# EAGLE design Minimum LPC2148+GPS (EAGLE 6.91.2)
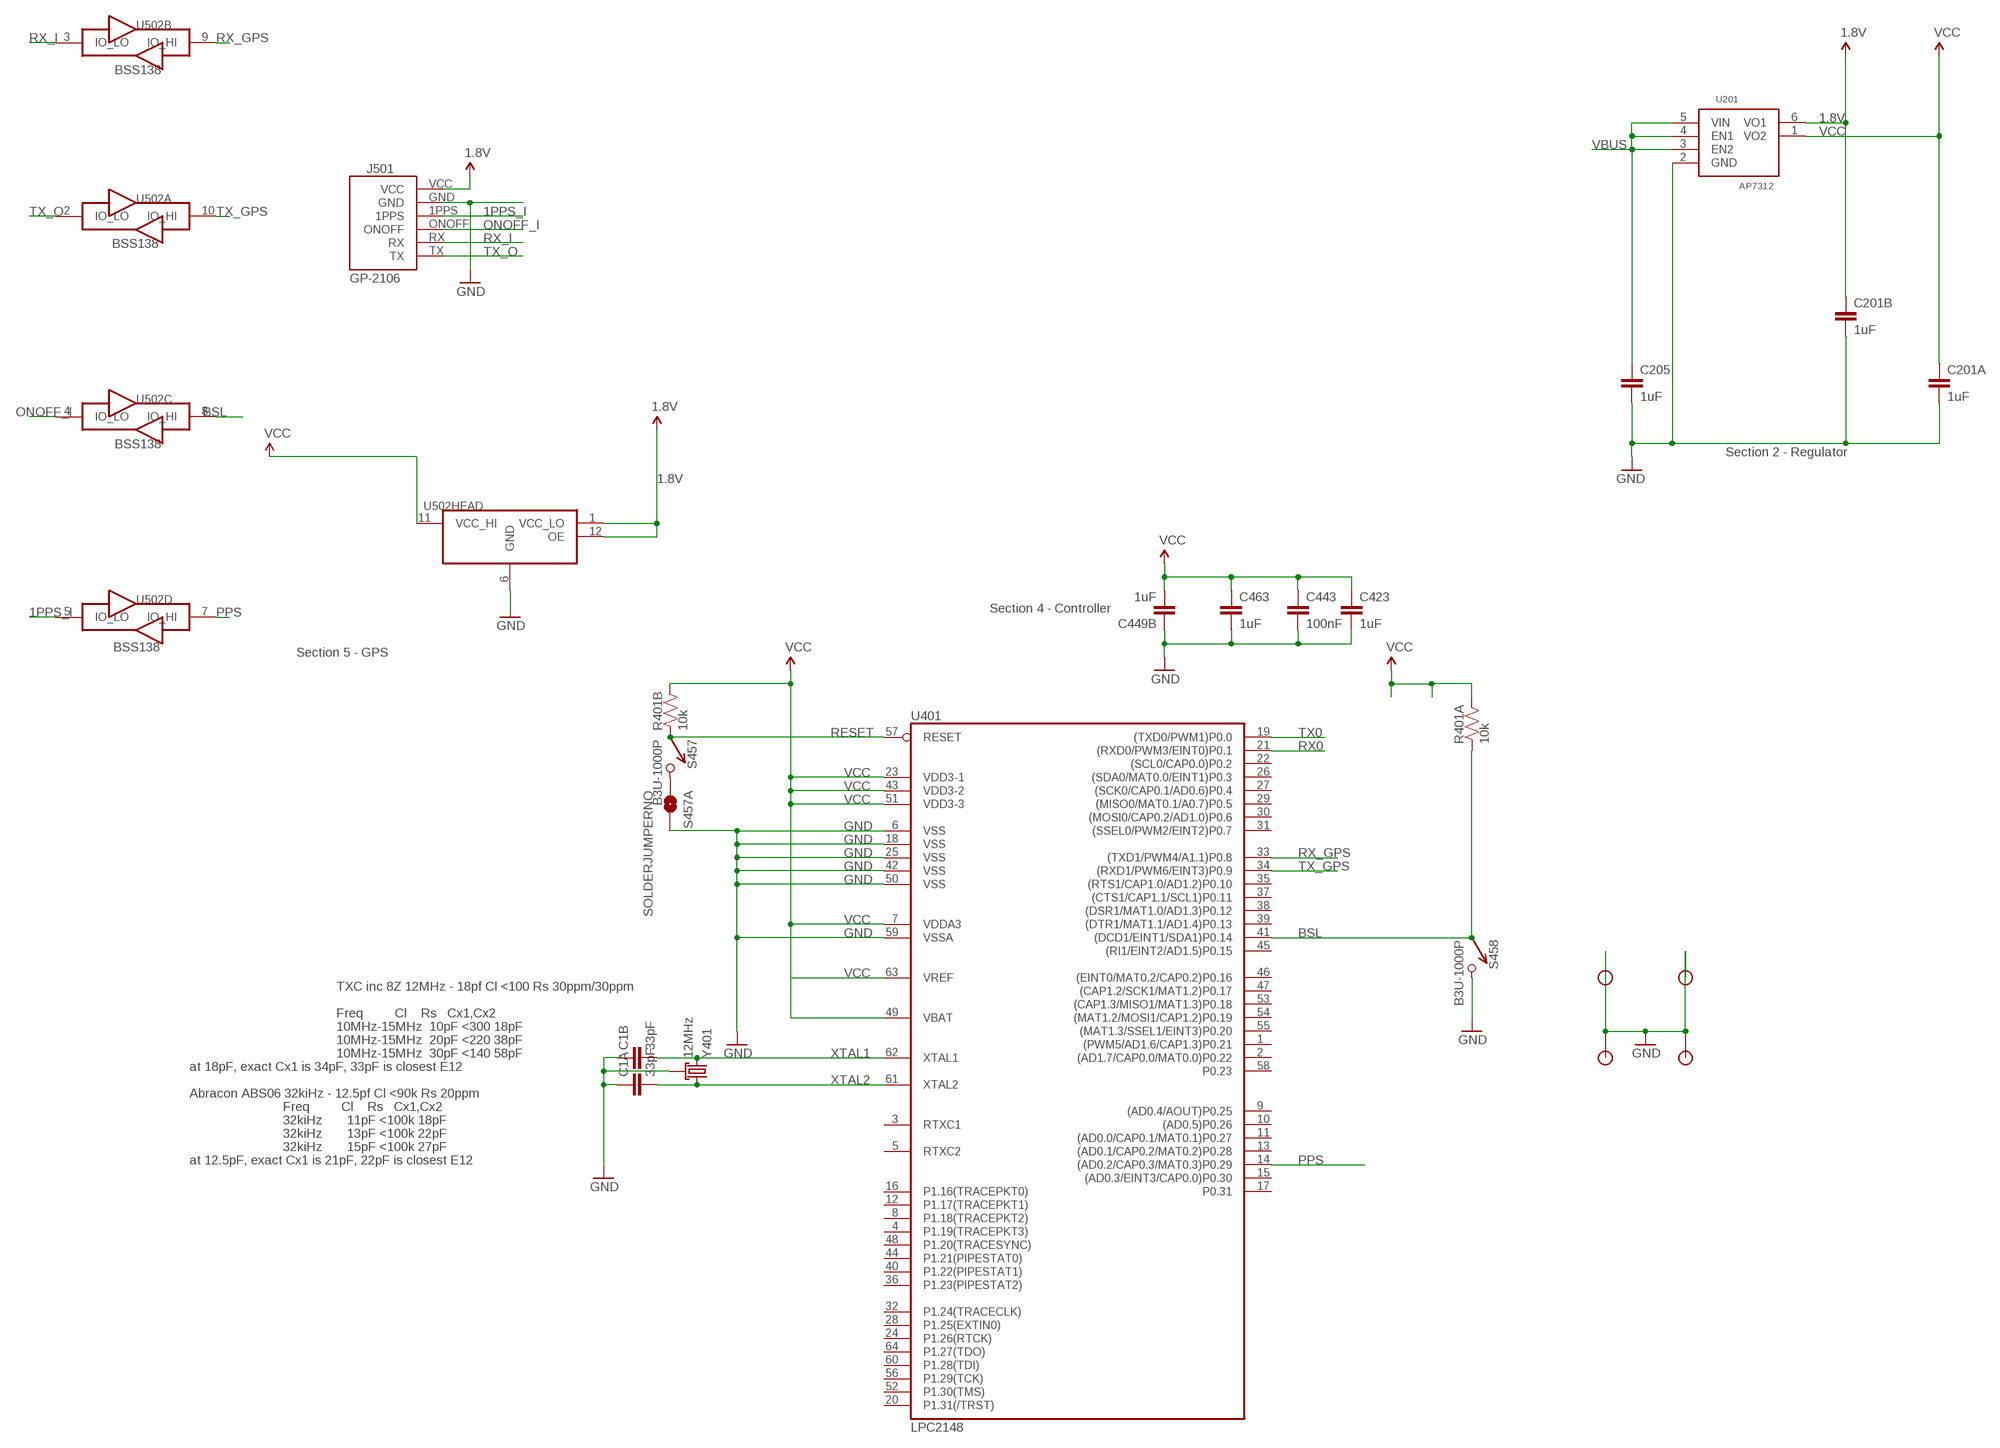
[diagram p0: schematic, sheet 1]

## Parts
C1  33pF  CKCM25  [CKCM25]
C201  1uF  CKCM25  [CKCM25]
C205  1uF  CAP0402-CAP  [0402-CAP]
C423  1uF  CAP0402-CAP  [0402-CAP]
C443  100nF  CAP0402-CAP  [0402-CAP]
C449  1uF  CKCM25  [CKCM25]
C463  1uF  CAP0402-CAP  [0402-CAP]
J501  GP-2106  [GP-2106]
JP1  STANDOFF  [STANDOFF]
JP2  STANDOFF  [STANDOFF]
JP4  STANDOFF  [STANDOFF]
JP5  STANDOFF  [STANDOFF]
R401  10k  RP2EXB24V  [CRA02]
S457  B3U-1000P  [B3U-1000P]
S457A  SOLDERJUMPERNO  [SJ_2S-NO]
S458  B3U-1000P  [B3U-1000P]
U201  AP7312  AP73X2  [SOT-23-6]
U401  LPC2148  LPC213X  [SQFP-S-10X10-64]
U502  TXB0104RUT  [R-PUQFN-N12]
Y401  12MHz  CX2520  [CRYSTAL_SMD_2MM_2_5MM]

## Nets
1.8V: C201.2 J501.VCC U201.6(VO1) U502.1(HEAD:VCC_LO) U502.12(HEAD:OE)
1PPS_I: J501.1PPS U502.5(D:IO_LO)
BSL: R401.1 S458.P$1 U401.41((DCD1/EINT1/SDA1)P0.14) U502.8(C:IO_HI)
GND [power]: C1.1 C1.2 C201.3 C201.4 C205.2 C423.2 C443.2 C449.2 C463.2 J501.GND JP1.P$1 JP2.P$1 JP4.P$1 JP5.P$1 S457A.2 S458.P$2 U201.2(GND) U401.6(VSS) U401.18(VSS) U401.25(VSS) U401.42(VSS) U401.50(VSS) U401.59(VSSA) U502.6(HEAD:GND) Y401.2(GND) Y401.4(GND)
N$8: S457.P$2 S457A.1
ONOFF_I: J501.ONOFF U502.4(C:IO_LO)
PPS: U401.14((AD0.2/CAP0.3/MAT0.3)P0.29) U502.7(D:IO_HI)
RESET [power]: R401.2 S457.P$1 U401.57(RESET)
RX0: U401.21((RXD0/PWM3/EINT0)P0.1)
RX_GPS: U401.33((TXD1/PWM4/A1.1)P0.8) U502.9(B:IO_HI)
RX_I: J501.RX U502.3(B:IO_LO)
TX0: U401.19((TXD0/PWM1)P0.0)
TX_GPS: U401.34((RXD1/PWM6/EINT3)P0.9) U502.10(A:IO_HI)
TX_O: J501.TX U502.2(A:IO_LO)
VBUS [power]: C205.1 U201.3(EN2) U201.4(EN1) U201.5(VIN)
VCC [power]: C201.1 C423.1 C443.1 C449.3 C463.1 R401.3 R401.4 U201.1(VO2) U401.7(VDDA3) U401.23(VDD3-1) U401.43(VDD3-2) U401.49(VBAT) U401.51(VDD3-3) U401.63(VREF) U502.11(HEAD:VCC_HI)
XTAL1: C1.3 U401.62(XTAL1) Y401.3
XTAL2: C1.4 U401.61(XTAL2) Y401.1
Unconnected: C449.1 C449.4 U401.1((PWM5/AD1.6/CAP1.3)P0.21) U401.2((AD1.7/CAP0.0/MAT0.0)P0.22) U401.3(RTXC1) U401.4(P1.19(TRACEPKT3)) U401.5(RTXC2) U401.8(P1.18(TRACEPKT2)) U401.9((AD0.4/AOUT)P0.25) U401.10((AD0.5)P0.26) U401.11((AD0.0/CAP0.1/MAT0.1)P0.27) U401.12(P1.17(TRACEPKT1)) U401.13((AD0.1/CAP0.2/MAT0.2)P0.28) U401.15((AD0.3/EINT3/CAP0.0)P0.30) U401.16(P1.16(TRACEPKT0)) U401.17(P0.31) U401.20(P1.31(/TRST)) U401.22((SCL0/CAP0.0)P0.2) U401.24(P1.26(RTCK)) U401.26((SDA0/MAT0.0/EINT1)P0.3) U401.27((SCK0/CAP0.1/AD0.6)P0.4) U401.28(P1.25(EXTIN0)) U401.29((MISO0/MAT0.1/A0.7)P0.5) U401.30((MOSI0/CAP0.2/AD1.0)P0.6) U401.31((SSEL0/PWM2/EINT2)P0.7) U401.32(P1.24(TRACECLK)) U401.35((RTS1/CAP1.0/AD1.2)P0.10) U401.36(P1.23(PIPESTAT2)) U401.37((CTS1/CAP1.1/SCL1)P0.11) U401.38((DSR1/MAT1.0/AD1.3)P0.12) U401.39((DTR1/MAT1.1/AD1.4)P0.13) U401.40(P1.22(PIPESTAT1)) U401.44(P1.21(PIPESTAT0)) U401.45((RI1/EINT2/AD1.5)P0.15) U401.46((EINT0/MAT0.2/CAP0.2)P0.16) U401.47((CAP1.2/SCK1/MAT1.2)P0.17) U401.48(P1.20(TRACESYNC)) U401.52(P1.30(TMS)) U401.53((CAP1.3/MISO1/MAT1.3)P0.18) U401.54((MAT1.2/MOSI1/CAP1.2)P0.19) U401.55((MAT1.3/SSEL1/EINT3)P0.20) U401.56(P1.29(TCK)) U401.58(P0.23) U401.60(P1.28(TDI)) U401.64(P1.27(TDO))

## Notes on the sheet
- BSS138
- BSS138
- BSS138
- Section 2 - Regulator
- Section 4 - Controller
- BSS138
- Section 5 - GPS
- TXC inc 8Z 12MHz - 18pf Cl <100 Rs 30ppm/30ppm
- Freq         Cl    Rs   Cx1,Cx2
- 10MHz-15MHz  10pF <300 18pF
- 10MHz-15MHz  20pF <220 38pF
- 10MHz-15MHz  30pF <140 58pF
- at 18pF, exact Cx1 is 34pF, 33pF is closest E12
- Abracon ABS06 32kiHz - 12.5pf Cl <90k Rs 20ppm
- Freq         Cl    Rs   Cx1,Cx2
- 32kiHz       11pF <100k 18pF
- 32kiHz       13pF <100k 22pF
- 32kiHz       15pF <100k 27pF
- at 12.5pF, exact Cx1 is 21pF, 22pF is closest E12

## Library data of the parts
C1 C201 C449 = KwanSystems:CKC
C205 C423 C463 = SparkFun:CAP: Capacitor Standard 0603 ceramic capacitor, and 0.1" leaded capacitor.; DIGIKEY: 445-4114-1-ND
C443 = SparkFun:CAP: Capacitor Standard 0603 ceramic capacitor, and 0.1" leaded capacitor.; DIGIKEY: 445-1265-1-ND
J501 = SparkFun:GP-2106: GP-2106 GPS SiRF IV
JP1 JP2 JP4 JP5 = KwanSystems:STANDOFF; DIGIKEY: $NOPART
R401 = KwanSystems:RP2; DIGIKEY: CRA4S810KCT-ND
S457 S458 = KwanSystems:B3U-1000P; DIGIKEY: SW1020CT-ND
S457A = SparkFun-Passives:SOLDERJUMPER: Solder Jumper Standard SMD solder jumper. Used to automate production. Two varients : Normally Open and Normally Closed are the same, but have different paste layers. NC will have a large amount of paste and should jumper during reflow.; DIGIKEY: $NOPART
U201 = KwanSystems:AP73X2: Dual 300mA LDO Regulator http://www.diodes.com/datasheets/AP7332.pdf
U401 = SparkFun:LPC213X: LPC213x Schematic element and footprint for NXP LPC213x. Spark Fun Electronics SKU : COM-00520; DIGIKEY: 568-1765-ND
U502 = KwanSystems:TXB0104
Y401 = KwanSystems:CX2520; DIGIKEY: 887-1487-1-ND

## Net classes
0 default: width 0.152 mm, drill 0.33 mm, clearance 0.152 mm
1 power: width 0.152 mm, drill 0.33 mm, clearance 0.152 mm to class 0, clearance 0.152 mm
2 hv: width 0.152 mm, drill 0.33 mm, clearance 0.152 mm to class 0, clearance 0.152 mm to class 1, clearance 0.152 mm

## Board
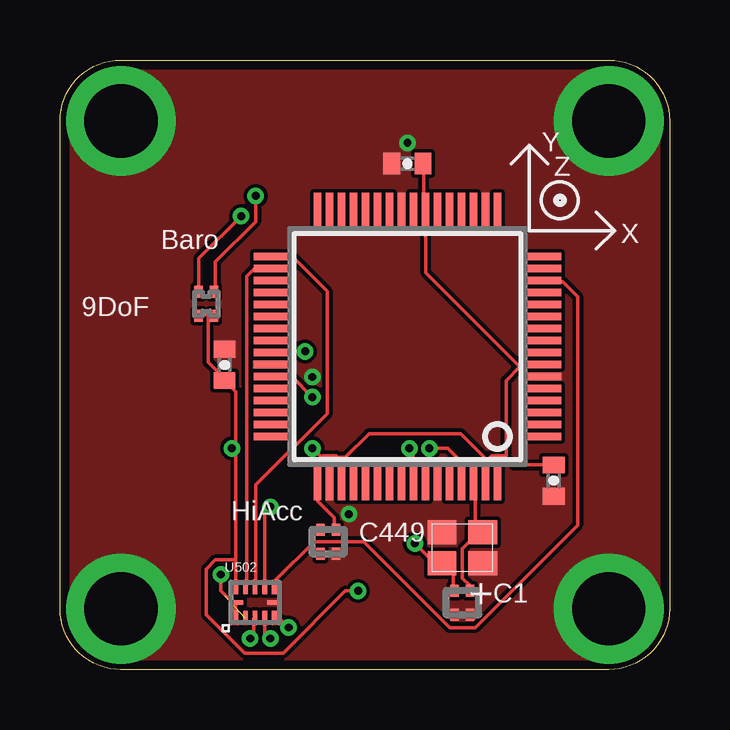
[diagram p1: board, top side]
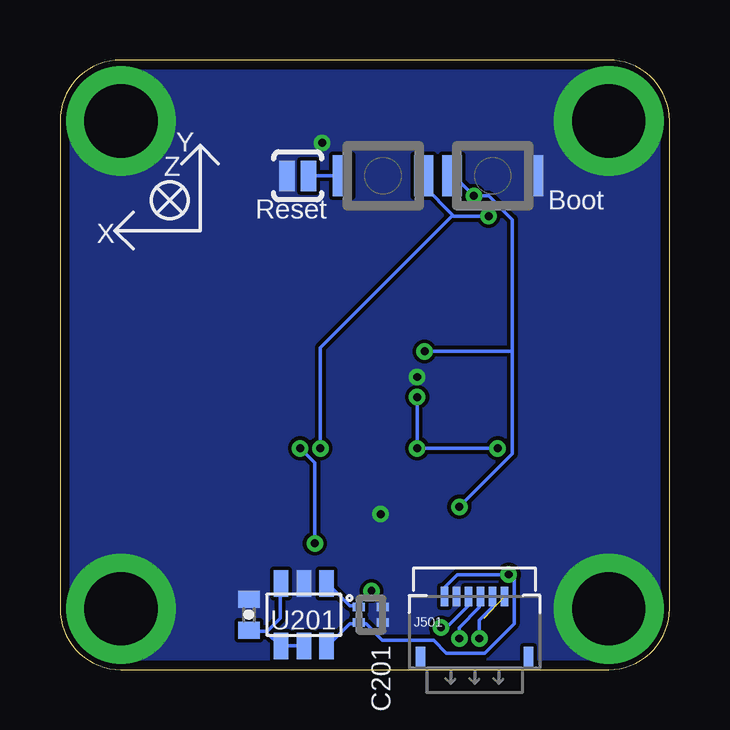
[diagram p2: board, bottom side, seen from below]

Size 25.4 x 25.4 mm. Coordinates in mm from the lower left corner, seen from the top.
Outline: 2.54,25.4 22.86,25.4 arc-90 25.4,22.86 25.4,2.54 arc-90 22.86,0 2.54,0 arc-90 0,2.54 0,22.86 arc-90 2.54,25.4
Copper layers (1*16): Top 0.0356mm / dielectric 1.5011mm / Bottom 0.0356mm
Design rules "default": minimum track width 6mil, minimum drill 13mil, track to track 6mil, track to pad 6mil, pad to pad 6mil, via to via 6mil, smd to smd 6mil, copper to edge 15mil, drill to drill 6mil, minimum pad ring 7mil, minimum via ring 7mil, stop-mask expansion 4mil, vias tented up to drill 14mil, thermal gap 10mil

### Footprints (pad centres in the part's own frame; a part is rotated, then mirrored left to right if it is on the bottom)
CKCM25 = smd 0.35 x 0.5: 1 -0.325,-0.5; 2 0.325,-0.5; 3 0.325,0.5; 4 -0.325,0.5
0402-CAP = smd 0.7 x 0.9: 1 -0.65,0; 2 0.65,0
GP-2106 = smd 0.3 x 0.8: 1PPS -0.25,0; GND -0.75,0; ONOFF 0.25,0; RX 0.75,0; TX 1.25,0; VCC -1.25,0 | smd 0.4 x 0.8: P$7 -2.25,-2.5; P$8 2.25,-2.5
STANDOFF = drill 3.048 pad 4.572: P$1 0,0
CRA02 = smd 0.35 x 0.5: 1 -0.325,-0.5; 2 0.325,-0.5; 3 0.325,0.5; 4 -0.325,0.5
B3U-1000P = smd 0.8 x 1.7: P$1 -1.7,0; P$2 1.7,0
SJ_2S-NO = smd 0.635 x 1.27: 1 -0.45,0; 2 0.45,0
SOT-23-6 = smd 0.6 x 1.1: 1 -0.95,-1.3; 2 0,-1.3; 3 0.95,-1.3; 4 0.95,1.3; 5 0,1.3; 6 -0.95,1.3
SQFP-S-10X10-64 = smd 0.3 x 1.6: 1 -3.75,-5.6; 2 -3.25,-5.6; 3 -2.75,-5.6; 4 -2.25,-5.6; 5 -1.75,-5.6; 6 -1.25,-5.6; 7 -0.75,-5.6; 8 -0.25,-5.6; 9 0.25,-5.6; 10 0.75,-5.6; 11 1.25,-5.6; 12 1.75,-5.6; 13 2.25,-5.6; 14 2.75,-5.6; 15 3.25,-5.6; 16 3.75,-5.6; 33 3.75,5.6; 34 3.25,5.6; 35 2.75,5.6; 36 2.25,5.6; 37 1.75,5.6; 38 1.25,5.6; 39 0.75,5.6; 40 0.25,5.6; 41 -0.25,5.6; 42 -0.75,5.6; 43 -1.25,5.6; 44 -1.75,5.6; 45 -2.25,5.6; 46 -2.75,5.6; 47 -3.25,5.6; 48 -3.75,5.6 | smd 1.6 x 0.3: 17 5.6,-3.75; 18 5.6,-3.25; 19 5.6,-2.75; 20 5.6,-2.25; 21 5.6,-1.75; 22 5.6,-1.25; 23 5.6,-0.75; 24 5.6,-0.25; 25 5.6,0.25; 26 5.6,0.75; 27 5.6,1.25; 28 5.6,1.75; 29 5.6,2.25; 30 5.6,2.75; 31 5.6,3.25; 32 5.6,3.75; 49 -5.6,3.75; 50 -5.6,3.25; 51 -5.6,2.75; 52 -5.6,2.25; 53 -5.6,1.75; 54 -5.6,1.25; 55 -5.6,0.75; 56 -5.6,0.25; 57 -5.6,-0.25; 58 -5.6,-0.75; 59 -5.6,-1.25; 60 -5.6,-1.75; 61 -5.6,-2.25; 62 -5.6,-2.75; 63 -5.6,-3.25; 64 -5.6,-3.75
R-PUQFN-N12 = smd 0.2 x 0.6: 1 -0.8,-0.65; 2 -0.4,-0.65; 3 0,-0.65; 4 0.4,-0.65; 5 0.8,-0.65; 7 0.8,0.65; 8 0.4,0.65; 9 0,0.65; 10 -0.4,0.65; 11 -0.8,0.65 | smd 0.6 x 0.2: 6 0.8,0; 12 -0.8,0
CRYSTAL_SMD_2MM_2_5MM = smd 1.2 x 1: 1 -0.85,-0.65; 2 0.85,-0.65; 3 0.85,0.65; 4 -0.85,0.65

### Placement (x,y rotation side)
C1  16.76,2.79 0 top
C201  12.45,2.29 270 bottom
C205  17.53,2.29 90 bottom
C423  14.48,21.08 180 top
C443  6.86,12.7 90 top
C449  11.18,5.33 0 top
C463  20.57,7.87 270 top
J501  8.13,3.05 0 bottom
JP1  2.54,2.54 0 top
JP2  2.54,22.86 0 top
JP4  22.86,2.54 0 top
JP5  22.86,22.86 0 top
R401  6.1,15.24 180 top
S457  11.94,20.57 180 bottom
S457A  15.49,20.57 180 bottom
S458  7.37,20.57 0 bottom
U201  15.24,2.29 180 bottom
U401  14.48,13.46 90 top
U502  8.13,2.79 0 top
U$4  [AXES]  19.56,18.29 0 top
Y401  16.76,5.08 0 top

### Tracks (layer width: path | path; a pad name or v marks a point on that pad's centre or on a via)
1.8V  (via drill 0.33)
  Top 0.152: U502.1 7.32,2.21 7.32,2.74 U502.12 7.24,2.74 6.71,3.28 v6.71,3.96
  Bottom 0.152: U201.6 14.25,0.99 13.34,1.91 12.95,1.91 C201.2 12.88,1.91 12.65,1.91 11.96,1.22 9.83,1.22 9.3,0.69 7.7,0.69 6.48,1.91 6.48,3.73 v6.71,3.96 8.84,3.96 9.37,3.43 J501.VCC
1PPS_I  (via drill 0.33)
  Top 0.152: v9.53,1.75 9.14,2.13 8.99,2.13 U502.5
  Bottom 0.152: v9.53,1.75 9.3,1.75 8.38,2.67 J501.1PPS
BSL  (via drill 0.33)
  Top 0.152: v8.15,19.74 8.15,18.67 6.48,16.99 6.48,15.77 R401.1 | v8.76,6.78 8.53,6.55 8.53,3.5 U502.8 | v10.21,13.26 8.91,13.26 U401.41
  Bottom 0.152: S458.P$1 8.99,20.57 v8.15,19.74 7.54,19.74 6.55,18.75 6.55,13.26 | v8.76,6.78 6.55,8.99 6.55,13.26 | 6.55,13.26 v10.21,13.26
GND  (via drill 0.33)
  other vias: 14.48,21.95 10.52,12.19 12.04,6.48
  pour Top (no thermals): 2.54,25.4 22.86,25.4 25.4,25.4 25.4,2.54 arc-90 22.86,0 2.54,0 arc-90 0,2.54 0,22.86 arc-90
  pour Bottom (no thermals): 2.54,25.4 22.86,25.4 25.4,25.4 25.4,2.54 arc-90 22.86,0 2.54,0 arc-90 0,2.54 0,22.86 arc-90
N$8
  Bottom 0.152: S457.P$2 S457A.1
ONOFF_I  (via drill 0.33)
  Top 0.152: v8.76,1.29 8.53,1.52 U502.4
  Bottom 0.152: v8.76,1.29 8.76,1.75 7.92,2.59 7.92,3.05 J501.ONOFF
PPS
  Top 0.152: U502.7 8.99,3.5 8.99,3.73 10.59,5.33 12.65,5.33 16.23,1.75 17.3,1.75 21.57,6.02 21.57,15.54 20.95,16.15 20.12,16.15 U401.14
RESET  (via drill 0.33)
  Top 0.152: v7.54,18.9 5.79,17.14 5.79,15.77 R401.2 | v14.55,9.22 14.71,9.07 14.71,7.92 U401.57
  Bottom 0.152: v7.54,18.9 8.99,18.9 9.03,18.94 | 9.03,18.94 10.21,20.12 10.21,20.57 S457.P$1 | v14.55,9.22 14.55,13.41 9.03,18.94
RX_GPS
  Top 0.152: U502.9 8.15,3.5 8.15,7.7 11.12,10.67 11.12,15.77 9.75,17.14 8.91,17.14 U401.33
RX_I  (via drill 0.33)
  Top 0.152: v7.92,1.29 8.08,1.45 8.08,2.13 U502.3
  Bottom 0.152: v7.92,1.29 7.92,2.06 7.39,2.59 J501.RX
TX_GPS
  Top 0.152: U502.10 7.77,3.5 7.77,16.38 8.08,16.69 8.84,16.69 U401.34
TX_O  (1 unrouted)
VBUS
  Bottom 0.152: 16.8,1.56 16.23,0.99 U201.4 16.15,0.99 U201.5 | 16.8,1.56 16.84,1.6 17.53,1.6 C205.1 | 16.8,1.56 16.23,2.13 16.23,3.58 U201.3
VCC  (via drill 0.33)
  Top 0.152: 6.17,14.78 6.4,14.78 R401.4 | 6.17,14.78 5.79,14.78 R401.3 | 7.32,9.22 7.32,11.58 C443.1 6.86,12.12 6.17,12.8 6.17,14.78 | 7.32,9.22 7.32,4.57 | 7.32,4.57 7.32,3.5 U502.11 | v12.42,3.28 11.89,3.28 9.3,0.69 7.7,0.69 6.1,2.29 6.1,4.19 6.48,4.57 7.32,4.57 | C449.3 11.43,5.87 11.43,6.33 10.74,7.01 10.74,7.85 U401.49 10.74,7.92 10.74,8.69 10.9,8.84 | 11.62,8.8 11.51,8.91 10.97,8.91 10.9,8.84 | 11.62,8.8 11.66,8.76 11.66,7.92 U401.51 | v10.52,11.35 9.68,12.19 8.91,12.19 U401.43 | 10.9,8.84 v10.52,9.22 | C423.1 15.16,21.03 15.16,19.13 U401.23 15.24,16.54 19.16,12.61 | 18.55,8.88 18.52,8.91 17.98,8.91 17.79,8.72 | 18.55,8.88 18.9,8.53 20.57,8.53 C463.1 | 17.79,8.72 17.75,8.69 17.75,7.92 U401.63 | 19.16,12.61 18.59,12.04 18.59,8.91 18.55,8.88 | 19.16,12.61 19.2,12.65 20.04,12.65 U401.7 | 17.79,8.72 16.69,9.83 12.88,9.83 11.89,8.84 11.66,8.84 11.62,8.8 | v7.16,9.22 7.32,9.22
  Bottom 0.152: U201.1 14.25,3.58 13.34,2.67 12.95,2.67 C201.1 12.95,2.74 v12.42,3.28 | v10.52,11.35 v10.52,9.22 v7.16,9.22
XTAL1
  Top 0.152: C1.3 17.07,3.35 17.07,3.5 16.76,3.81 16.76,5.03 17.45,5.71 17.6,5.71 Y401.3 17.3,5.64 17.3,7.85 U401.62
XTAL2  (via drill 0.33)
  Top 0.152: C1.4 16.38,3.35 16.38,3.96 15.93,4.42 Y401.1 15.85,4.5 15.54,4.5 v14.78,5.26 | v15.39,9.22 16.15,9.22 16.69,8.69 16.69,7.92 U401.61
  Bottom 0.152: v14.78,5.26 14.78,8.61 v15.39,9.22

### Text on the board
tPlace: Baro | 9DoF | HiAcc | +
bPlace: Boot | Reset